# EAGLE design switchmod (EAGLE 7.7.0)
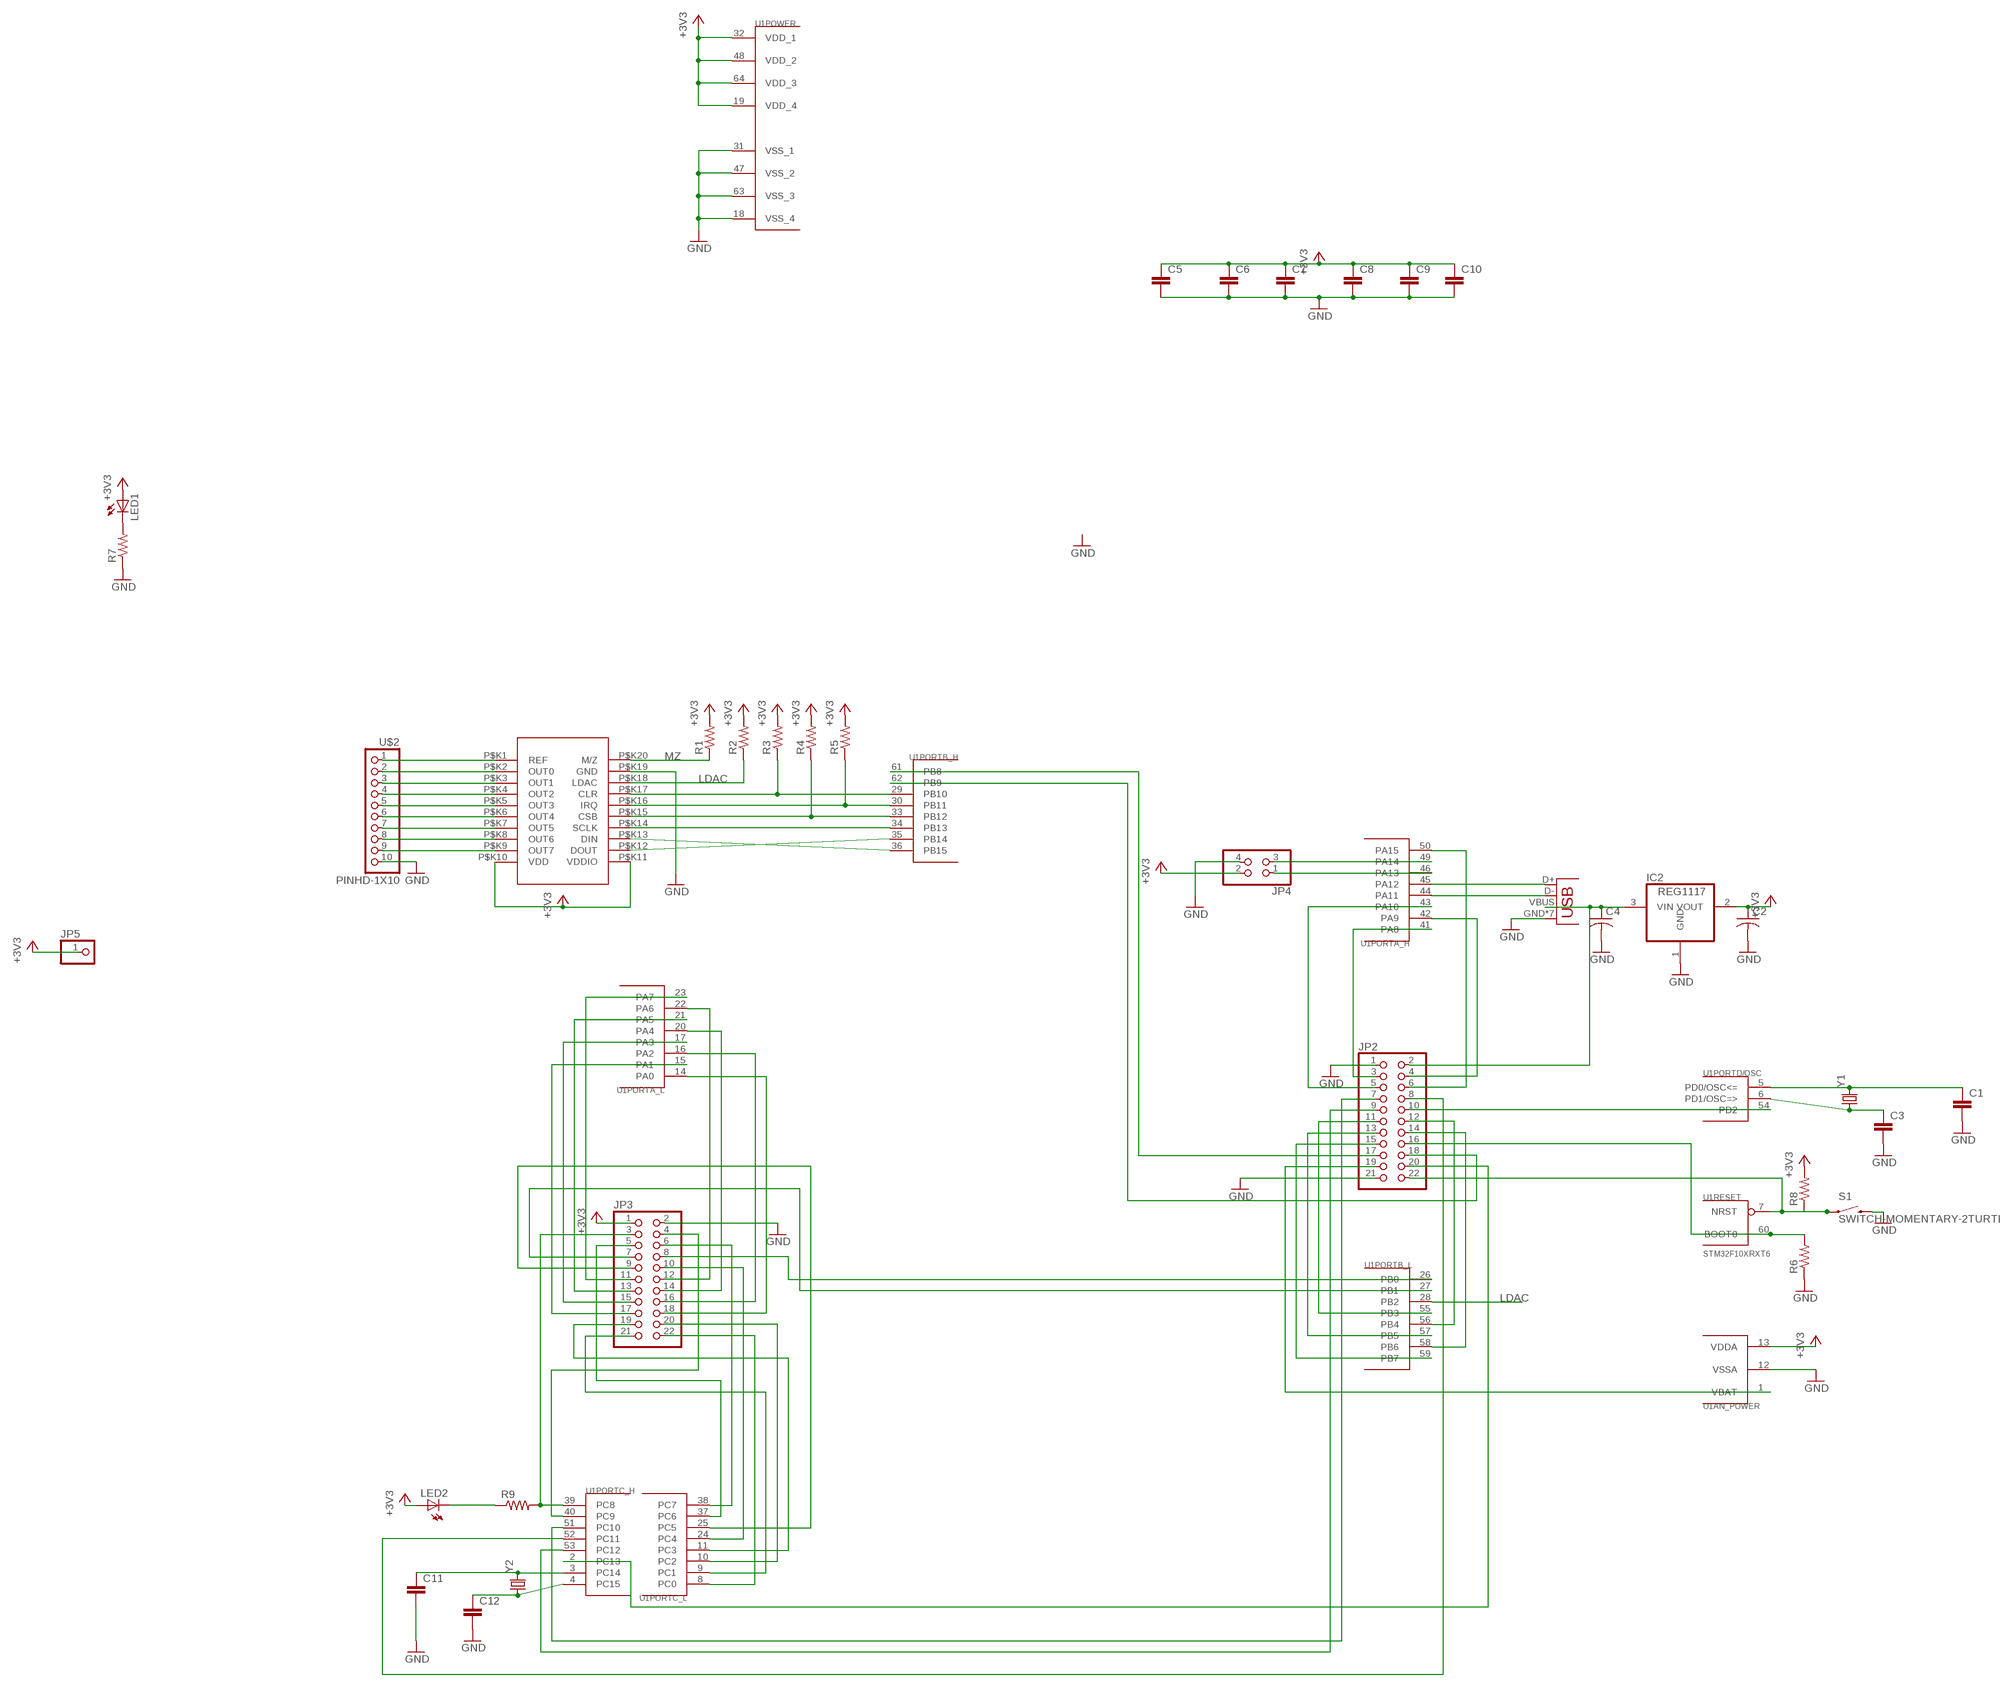
[diagram p0: schematic, sheet 1]

## Parts
C1  CAP0805  [0805]
C2  C-USC1210  [C1210]
C3  CAP0805  [0805]
C4  C-USC1210  [C1210]
C5  CAP0805  [0805]
C6  CAP0805  [0805]
C7  CAP0805  [0805]
C8  CAP0805  [0805]
C9  CAP0805  [0805]
C10  CAP0805  [0805]
C11  CAP0805  [0805]
C12  CAP0805  [0805]
IC2  REG1117  [SOT223]
JP2  PINHD-2X11  [2X11]
JP3  PINHD-2X11  [2X11]
JP4  PINHD-2X2  [2X02]
JP5  PINHD-1X1  [1X01]
LED1  LEDCHIP-LED0805  [CHIP-LED0805]
LED2  LEDCHIP-LED0805  [CHIP-LED0805]
R1  RESISTOR0805-RES  [0805]
R2  RESISTOR0805-RES  [0805]
R3  RESISTOR0805-RES  [0805]
R4  RESISTOR0805-RES  [0805]
R5  RESISTOR0805-RES  [0805]
R6  RESISTOR0805-RES  [0805]
R7  RESISTOR0805-RES  [0805]
R8  RESISTOR0805-RES  [0805]
R9  RESISTOR0805-RES  [0805]
S1  SWITCH-MOMENTARY-2TURTLE  [KMR2]
U1  STM32F10XRXT6  [TQFP64]
U$1  MAX572X  [TSSOP20]
U$2  PINHD-1X10  [1X10-BIG]
X1  USB-MICROB  [USB-MICROB]
Y1  CRYSTALHC49US  [HC49US]
Y2  CRYSTALTC26H_EZ  [TC26HEZ]

## Nets
+3V3: C2.1 C5.1 C6.1 C7.1 C8.1 C9.1 C10.1 IC2.2(VOUT) JP3.1 JP4.2 JP5.1 LED1.A LED2.A R1.2 R2.2 R3.2 R4.2 R5.2 R8.2 U1.13(AN_POWER:VDDA) U1.19(POWER:VDD_4) U1.32(POWER:VDD_1) U1.48(POWER:VDD_2) U1.64(POWER:VDD_3) U$1.P$K10(VDD) U$1.P$K11(VDDIO)
GND: C1.2 C2.2 C3.2 C4.2 C5.2 C6.2 C7.2 C8.2 C9.2 C10.2 C11.2 C12.2 IC2.1(GND) JP2.1 JP2.21 JP3.2 JP4.4 R6.1 R7.1 S1.3 U1.12(AN_POWER:VSSA) U1.18(POWER:VSS_4) U1.31(POWER:VSS_1) U1.47(POWER:VSS_2) U1.63(POWER:VSS_3) U$1.P$K19(GND) U$2.10 X1.GND X1.P1(GND) X1.P2(GND) X1.P3(GND) X1.P4(GND) X1.P5(GND) X1.P6(GND)
LDAC: R2.1 U1.28(PORTB_L:PB2) U$1.P$K18(LDAC)
MZ: R1.1 U$1.P$K20(M/Z)
N$1: JP2.22 R8.1 S1.1 U1.7(RESET:NRST)
N$3: U1.44(PORTA_H:PA11) X1.D-
N$4: U1.45(PORTA_H:PA12) X1.D+
N$5: C1.1 U1.5(PORTD/OSC:PD0/OSC<=) Y1.2
N$6: C3.1 U1.6(PORTD/OSC:PD1/OSC=>) Y1.1
N$7: U$1.P$K1(REF) U$2.1
N$8: U$1.P$K2(OUT0) U$2.2
N$9: U$1.P$K3(OUT1) U$2.3
N$10: U$1.P$K4(OUT2) U$2.4
N$11: U$1.P$K5(OUT3) U$2.5
N$12: U$1.P$K6(OUT4) U$2.6
N$13: U$1.P$K7(OUT5) U$2.7
N$14: U$1.P$K8(OUT6) U$2.8
N$15: U$1.P$K9(OUT7) U$2.9
N$16: U1.36(PORTB_H:PB15) U$1.P$K13(DIN)
N$17: U1.35(PORTB_H:PB14) U$1.P$K12(DOUT)
N$18: U1.34(PORTB_H:PB13) U$1.P$K14(SCLK)
N$19: R4.1 U1.33(PORTB_H:PB12) U$1.P$K15(CSB)
N$20: R5.1 U1.30(PORTB_H:PB11) U$1.P$K16(IRQ)
N$21: R3.1 U1.29(PORTB_H:PB10) U$1.P$K17(CLR)
N$22: JP4.3 U1.49(PORTA_H:PA14)
N$23: JP3.5 U1.37(PORTC_L:PC6)
N$24: JP4.1 U1.46(PORTA_H:PA13)
N$25: JP3.6 U1.38(PORTC_L:PC7)
N$26: JP2.16 R6.2 U1.60(RESET:BOOT0)
N$27: LED1.C R7.2
N$28: C11.1 U1.3(PORTC_H:PC14) Y2.2
N$29: C12.1 U1.4(PORTC_H:PC15) Y2.1
N$30: JP3.4 U1.40(PORTC_H:PC9)
N$31: JP2.3 U1.41(PORTA_H:PA8)
N$32: JP3.3 R9.2 U1.39(PORTC_H:PC8)
N$33: JP2.4 U1.42(PORTA_H:PA9)
N$34: JP2.5 U1.43(PORTA_H:PA10)
N$35: JP3.7 U1.27(PORTB_L:PB1)
N$36: JP3.8 U1.26(PORTB_L:PB0)
N$37: JP3.9 U1.25(PORTC_L:PC5)
N$38: JP3.10 U1.24(PORTC_L:PC4)
N$39: JP3.11 U1.23(PORTA_L:PA7)
N$40: JP3.12 U1.22(PORTA_L:PA6)
N$41: JP3.13 U1.21(PORTA_L:PA5)
N$42: JP3.14 U1.20(PORTA_L:PA4)
N$43: JP3.15 U1.17(PORTA_L:PA3)
N$44: JP3.16 U1.16(PORTA_L:PA2)
N$45: JP3.17 U1.15(PORTA_L:PA1)
N$46: JP3.18 U1.14(PORTA_L:PA0)
N$47: JP3.22 U1.8(PORTC_L:PC0)
N$48: JP3.21 U1.9(PORTC_L:PC1)
N$49: JP3.20 U1.10(PORTC_L:PC2)
N$50: JP3.19 U1.11(PORTC_L:PC3)
N$51: JP2.6 U1.50(PORTA_H:PA15)
N$52: JP2.7 U1.51(PORTC_H:PC10)
N$53: JP2.9 U1.53(PORTC_H:PC12)
N$54: JP2.8 U1.52(PORTC_H:PC11)
N$55: JP2.10 U1.54(PORTD/OSC:PD2)
N$56: JP2.11 U1.55(PORTB_L:PB3)
N$57: JP2.12 U1.56(PORTB_L:PB4)
N$58: JP2.13 U1.57(PORTB_L:PB5)
N$59: JP2.14 U1.58(PORTB_L:PB6)
N$60: JP2.15 U1.59(PORTB_L:PB7)
N$61: JP2.17 U1.61(PORTB_H:PB8)
N$62: JP2.18 U1.62(PORTB_H:PB9)
N$63: JP2.19 U1.1(AN_POWER:VBAT)
N$64: JP2.20 U1.2(PORTC_H:PC13)
N$65: LED2.C R9.1
N$66: C4.1 IC2.3(VIN) JP2.2 X1.VBUS

## Library data of the parts
C1 C3 C5-C12 = backplane:CAP: Capacitor Standard 0603 ceramic capacitor, and 0.1" leaded capacitor.
C2 C4 = backplane:C-US: CAPACITOR, American symbol
IC2 = backplane:REG1117: 800mA and 1A Low Dropout (LDO) Positive Regulator 1.8V, 2.5V, 2.85V, 3.3V, 5V, and Adj; MPN: REG1117; OC_FARNELL: 1097566; OC_NEWARK: 14P6981
JP2 JP3 = pinhead:PINHD-2X11: PIN HEADER
JP4 = pinhead:PINHD-2X2: PIN HEADER
JP5 = adafruit:PINHD-1X1: Pin header 1x1 for 0.1" spacing With round pins
LED1 LED2 = backplane:LED: LED OSRAM: - CHIPLED LG R971, LG N971, LY N971, LG Q971, LY Q971, LO R971, LY R971 LH N974, LH R974 LS Q976, LO Q976, LY Q976 LO Q996 - Hyper CHIPLED LW Q18S LB Q993, LB Q99A, LB R99A - SideLED LS A670, LO A670, LY A670, LG A670, LP A670 LB A673, LV A673, LT A673, LW A673 LH A674 LY A675 LS A676, LA A676, LO A676, LY A676, LW A676 LS A679, LY A679, LG A679 - Hyper Micro SIDELED® LS Y876, LA Y876, LO Y876, LY Y876 LT Y87S - SmartLED LW L88C, LW L88S LB L89C, LB L89S, LG L890 LS L89K, LO L89K, LY L89K LS L896, LA L896, LO L896, LY L896 - TOPLED LS T670, LO T670, LY T670, LG T670, LP T670 LSG T670, LSP T670, LSY T670, LOP T670, LYG T670 LG T671, LOG T671, LSG T671 LB T673, LV T673, LT T673, LW T673 LH T674 LS T676, LA T676, LO T676, LY T676, LB T676, LH T676, LSB T676, LW T676 LB T67C, LV T67C, LT T67C, LS T67K, LO T67K, LY T67K, LW E67C LS E67B, LA E67B, LO E67B, LY E67B, LB E67C, LV E67C, LT E67C LW T67C LS T679, LY T679, LG T679 LS T770, LO T770, LY T770, LG T770, LP T770 LB T773, LV T773, LT T773, LW T773 LH T774 LS E675, LA E675, LY E675, LS T675 LS T776, LA T776, LO T776, LY T776, LB T776 LHGB T686 LT T68C, LB T68C - Hyper Mini TOPLED® LB M676 - Mini TOPLED Santana® LG M470 LS M47K, LO M47K, LY M47K Source: http://www.osram.convergy.de/
R1-R9 = SparkFun-Passives:RESISTOR: Resistor Basic schematic elements and footprints for 0603, 1206, and PTH resistors.
S1 = Adafruit Feather M0 Adalogger:SWITCH-MOMENTARY-2: Various NO switches- pushbuttons, reed, etc
U1 = backplane:STM32F10XRXT6: STM32F101/103 64pin LQFP
U$1 = kevin:MAX572X
U$2 = adafruit:PINHD-1X10: Pin header 1x10 0.1" spacing With round pins
X1 = backplane:USB: USB Connectors USB-B-PTH is fully proven SKU : PRT-00139/CONN-08278 USB-miniB is fully proven SKU : PRT-00587 USB-A-PCB is untested. USB-A-H is throughly reviewed, but untested. Spark Fun Electronics SKU : PRT-00437 USB-B-SMT is throughly reviewed, but untested. Needs silkscreen touching up. USB-A-S has not been used/tested USB-MB-H has not been used/tested USB-MICROB has been used. CONN-09505; PROD_ID: CONN-09505
Y1 Y2 = backplane:CRYSTAL: Various standard crystals. Proven footprints.

## Board
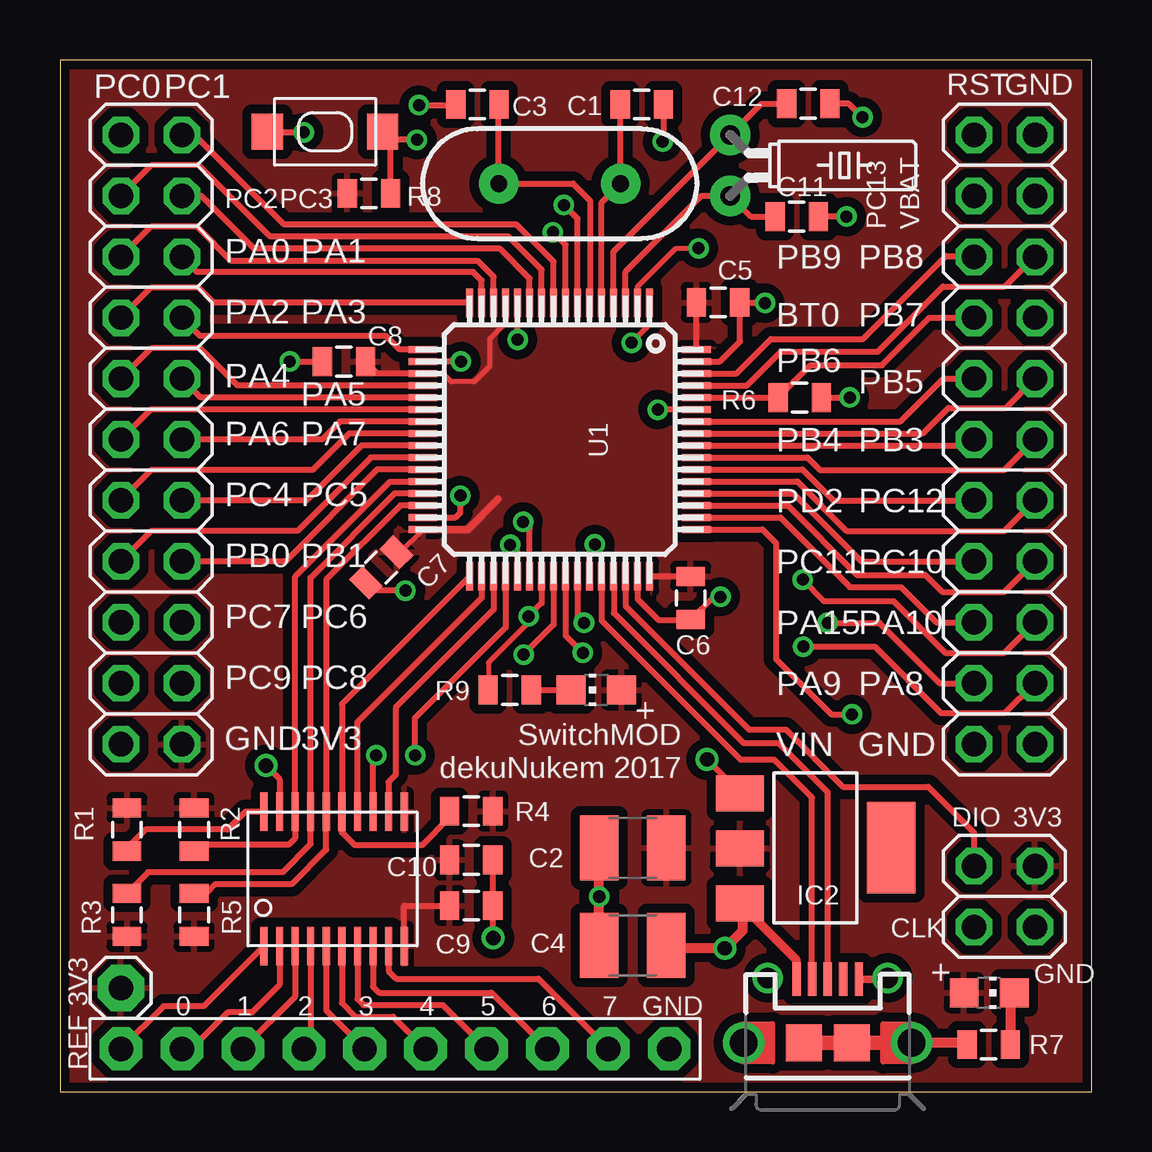
[diagram p1: board, top side]
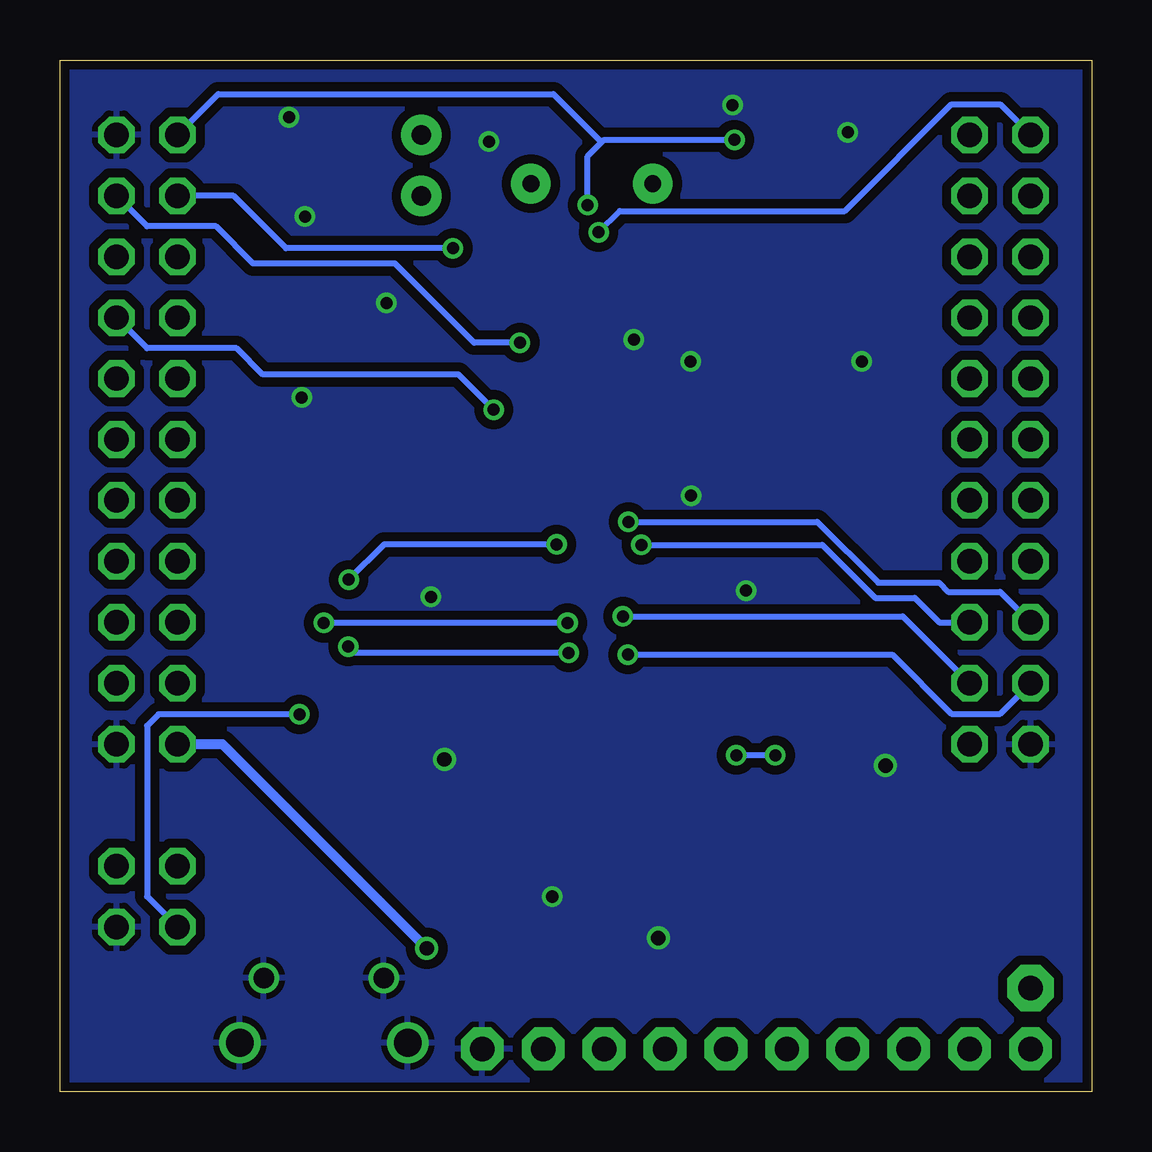
[diagram p2: board, bottom side, seen from below]

Size 43 x 43 mm. Coordinates in mm from the lower left corner, seen from the top.
Outline: 0,0 43,0 43,43 0,43 0,0
Copper layers (1*16): Top 0.035mm / dielectric 1.5mm / Bottom 0.035mm
Design rules "SparkFun-2-layer-TIGHT": minimum track width 7mil, minimum drill 15mil, track to track 7mil, track to pad 7mil, pad to pad 7mil, via to via 7mil, smd to smd 7mil, copper to edge 7mil, drill to drill 7mil, minimum pad ring 7mil, minimum via ring 7mil, stop-mask expansion 4mil, vias tented up to drill 25mil, thermal gap 10mil

### Footprints (pad centres in the part's own frame; a part is rotated, then mirrored left to right if it is on the bottom)
0805 = smd 0.8 x 1.2: 1 -0.9,0; 2 0.9,0
C1210 = smd 1.6 x 2.7: 1 -1.4,0; 2 1.4,0
SOT223 = smd 1.499 x 2.007: 1 -2.261,-3.15; 2 0.025,-3.15; 3 2.311,-3.15 | smd 3.81 x 2.007: 4 0,3.15
2X11 = drill 1.016 octagon: 1 -12.7,-1.27; 2 -12.7,1.27; 3 -10.16,-1.27; 4 -10.16,1.27; 5 -7.62,-1.27; 6 -7.62,1.27; 7 -5.08,-1.27; 8 -5.08,1.27; 9 -2.54,-1.27; 10 -2.54,1.27; 11 0,-1.27; 12 0,1.27; 13 2.54,-1.27; 14 2.54,1.27; 15 5.08,-1.27; 16 5.08,1.27; 17 7.62,-1.27; 18 7.62,1.27; 19 10.16,-1.27; 20 10.16,1.27; 21 12.7,-1.27; 22 12.7,1.27
2X02 = drill 1.016 octagon: 1 -1.27,-1.27; 2 -1.27,1.27; 3 1.27,-1.27; 4 1.27,1.27
1X01 = drill 1.016 pad 1.93 octagon: 1 0,0
CHIP-LED0805 = smd 1.2 x 1.2: A 0,-1.05; C 0,1.05
KMR2 = smd 1.3 x 1.5: 1 2.4,0; 3 -2.4,0
TQFP64 = smd 1.2 x 0.3: 1 -5.7,3.75; 2 -5.7,3.25; 3 -5.7,2.75; 4 -5.7,2.25; 5 -5.7,1.75; 6 -5.7,1.25; 7 -5.7,0.75; 8 -5.7,0.25; 9 -5.7,-0.25; 10 -5.7,-0.75; 11 -5.7,-1.25; 12 -5.7,-1.75; 13 -5.7,-2.25; 14 -5.7,-2.75; 15 -5.7,-3.25; 16 -5.7,-3.75; 33 5.7,-3.75; 34 5.7,-3.25; 35 5.7,-2.75; 36 5.7,-2.25; 37 5.7,-1.75; 38 5.7,-1.25; 39 5.7,-0.75; 40 5.7,-0.25; 41 5.7,0.25; 42 5.7,0.75; 43 5.7,1.25; 44 5.7,1.75; 45 5.7,2.25; 46 5.7,2.75; 47 5.7,3.25; 48 5.7,3.75 | smd 0.3 x 1.2: 17 -3.75,-5.7; 18 -3.25,-5.7; 19 -2.75,-5.7; 20 -2.25,-5.7; 21 -1.75,-5.7; 22 -1.25,-5.7; 23 -0.75,-5.7; 24 -0.25,-5.7; 25 0.25,-5.7; 26 0.75,-5.7; 27 1.25,-5.7; 28 1.75,-5.7; 29 2.25,-5.7; 30 2.75,-5.7; 31 3.25,-5.7; 32 3.75,-5.7; 49 3.75,5.7; 50 3.25,5.7; 51 2.75,5.7; 52 2.25,5.7; 53 1.75,5.7; 54 1.25,5.7; 55 0.75,5.7; 56 0.25,5.7; 57 -0.25,5.7; 58 -0.75,5.7; 59 -1.25,5.7; 60 -1.75,5.7; 61 -2.25,5.7; 62 -2.75,5.7; 63 -3.25,5.7; 64 -3.75,5.7
TSSOP20 = smd 0.3 x 1.6: P$K1 -2.93,-2.825; P$K2 -2.28,-2.825; P$K3 -1.63,-2.825; P$K4 -0.98,-2.825; P$K5 -0.33,-2.825; P$K6 0.32,-2.825; P$K7 0.97,-2.825; P$K8 1.62,-2.825; P$K9 2.27,-2.825; P$K10 2.92,-2.825; P$K11 2.92,2.775; P$K12 2.27,2.775; P$K13 1.62,2.775; P$K14 0.97,2.775; P$K15 0.32,2.775; P$K16 -0.33,2.775; P$K17 -0.98,2.775; P$K18 -1.63,2.775; P$K19 -2.28,2.775; P$K20 -2.93,2.775
1X10-BIG = drill 1.016 pad 1.778 octagon: 1 -11.43,0; 2 -8.89,0; 3 -6.35,0; 4 -3.81,0; 5 -1.27,0; 6 1.27,0; 7 3.81,0; 8 6.35,0; 9 8.89,0; 10 11.43,0
USB-MICROB = smd 0.35 x 1.4: D+ 0,2.65; D- -0.65,2.65; GND 1.3,2.65; ID 0.65,2.65; VBUS -1.3,2.65 | smd 1.5 x 1.55: P1 -1,0; P2 1,0 | drill 1.15 pad 1.422: P3 -3.5,0; P4 3.5,0 | drill 0.85 pad 1.27: P5 -2.5,2.7; P6 2.5,2.7
HC49US = drill 0.7 pad 1.651: 1 -2.54,0; 2 2.54,0
TC26HEZ = drill 0.813 pad 1.676: 1 -1.27,0; 2 1.27,0

### Placement (x,y rotation side)
C1  24.26,41.15 0 top
C2  23.88,10.16 180 top
C3  17.4,41.15 180 top
C4  23.88,6.1 180 top
C5  27.43,32.89 0 top
C6  26.29,20.57 270 top
C7  13.39,21.84 225 top
C8  11.84,30.43 180 top
C9  17.14,7.75 0 top
C10  17.14,9.65 0 top
C11  30.71,36.47 0 top
C12  31.19,41.17 0 top
IC2  31.5,10.16 270 top
JP2  39.37,27.18 90 top
JP3  3.81,27.18 90 top
JP4  39.37,8.13 270 top
JP5  2.54,4.32 0 top
LED1  38.73,4.11 270 top
LED2  22.35,16.74 90 top
R1  2.79,10.92 90 top
R2  5.59,10.92 90 top
R3  2.79,7.37 270 top
R4  17.14,11.68 0 top
R5  5.59,7.37 270 top
R6  30.84,28.93 180 top
R7  38.71,1.96 0 top
R8  12.88,37.44 180 top
R9  18.75,16.74 180 top
S1  11.05,40.01 0 top
U1  20.83,27.18 270 top
U$1  11.43,8.89 0 top
U$2  13.97,1.78 0 top
X1  32,2.03 0 top
Y1  20.83,37.85 0 top
Y2  27.94,38.61 270 top

### Tracks (layer width: path | path; a pad name or v marks a point on that pad's centre or on a via)
+3V3
  Top 0.203: C7.1 14.18,22.48 U1.32 | 18.59,32.86 18.59,32.05 17.91,31.37 17.91,30.23 17.27,29.59 16.31,29.59 15.98,29.92 U1.19
  Top 0.254: C6.1 U1.48 | 18.59,32.86 U1.13 | U1.64 C5.1 | U1.19 13.24,29.93 C8.1 | U$1.P$K10 14.35,7.75 16.18,7.75
  Top 0.305: U1.32 17,23.43 18.26,24.69
  pour Top (isolate 0.381): 0,43 0,0 43,0 43,43
GND  (via drill 0.5, 0.51, 0.6)
  Top 0.254: 34.45,4.68 X1.P6 | 14.95,41.13 v14.96,41.12 16.47,41.12 C3.2 | C1.2 25.16,39.63 v25.12,39.6 | C10.2 C9.2 18.06,7.73 v18.06,6.4 | v16.71,30.43 U1.18 | v19.07,31.34 U1.12 | U1.63 27.51,30.43 28.35,31.27 28.35,32.88 | 28.35,32.88 C5.2 | R6.1 v32.92,28.93 | v8.59,13.59 9.15,13.02 U$1.P$K19 | U1.31 16.49,23.93 16.69,24.13 v16.69,24.84 | v27.53,20.62 27.24,20.62 C6.2 26.27,19.66 24.94,19.66 24.08,20.52 U1.47 | S1.3 8.67,39.98 v10.16,39.98 | v9.58,30.43 C8.2 | R7.1 37.73,2.03 | v26.98,13.84 28.35,12.47 IC2.1 | 12.65,21.21 C7.2 | C7.2 12.83,21.21 | v14.4,20.88 13.08,20.88 C7.2 | 28.35,32.88 29.38,32.88 v29.39,32.87 | v32.79,36.47 C11.2 | v33.45,40.62 32.89,41.17 C12.2
  Top 0.305: X1.GND 34.45,4.68
  Top 0.406: 37.73,2.03 X1.P4 | C4.2 v22.48,8.13 C2.2
  Top 0.61: X1.P4 X1.P2 X1.P1
  pour Bottom (isolate 0.381): 0,43 0,0 43,0 43,43
LDAC
  Top 0.254: U$1.P$K18 9.8,11.12 | 9.8,11.12 9.8,10.56 9.53,10.29 5.85,10.29 R2.1 | 9.8,11.12 9.8,11.13 9.8,21.46 13.77,25.43 U1.28
MZ
  Top 0.254: U$1.P$K20 7.73,11.66 6.99,10.92 3.57,10.92 2.79,10.15 R1.1
N$1  (via drill 0.5)
  Top 0.254: U1.7 21.58,36.38 v21.01,36.96 | v14.88,39.67 13.78,39.67 S1.1 13.78,39.68 R8.1
  Bottom 0.254: v14.88,39.67 20.32,39.67 20.42,39.57 | 20.42,39.57 22.43,41.58 36.4,41.58 JP2.22 | v21.01,36.96 21.01,38.99 20.42,39.57
N$3
  Top 0.254: X1.D- 31.35,12.26 29.77,13.84 28.37,13.84 22.58,19.63 U1.44
N$4
  Top 0.254: X1.D+ 32,12.47 29.95,14.53 28.5,14.53 23.09,19.94 23.09,21.47 U1.45
N$5
  Top 0.254: C1.1 23.37,41.14 Y1.2 22.58,37.06 U1.5
N$6
  Top 0.254: C3.1 18.29,41.14 Y1.1 21.39,37.85 22.1,37.13 22.1,32.9 U1.6
N$7
  Top 0.254: U$1.P$K1 5.99,3.56 4.32,3.56 U$2.1
N$8
  Top 0.254: U$1.P$K2 9.15,4.45 8,3.3 6.99,3.3 5.46,1.78 U$2.2
N$9
  Top 0.254: U$1.P$K3 9.8,3.96 U$2.3
N$10
  Top 0.254: U$1.P$K4 10.45,2.07 U$2.4
N$11
  Top 0.254: U$1.P$K5 11.1,3.38 U$2.5
N$12
  Top 0.254: U$1.P$K6 11.75,3.69 12.32,3.12 13.89,3.12 U$2.6
N$13
  Top 0.254: U$1.P$K7 12.4,3.86 12.65,3.61 15.95,3.61 U$2.7
N$14
  Top 0.254: U$1.P$K8 13.05,4.37 13.31,4.12 17.98,4.12 U$2.8
N$15
  Top 0.254: U$1.P$K9 13.7,5.02 14.02,4.7 19.94,4.7 U$2.9
N$16  (via drill 0.5)
  Top 0.254: U$1.P$K13 13.05,13.89 v13.18,14.02 | U1.36 18.58,19.34 14.78,15.54 14.78,14.05 v14.81,14.02
  Bottom 0.254: v13.18,14.02 v14.81,14.02
N$17
  Top 0.254: U1.35 18.08,20.09 13.99,16 13.99,13.21 13.69,12.9 U$1.P$K12
N$18
  Top 0.254: U1.34 17.58,20.57 12.39,15.39 U$1.P$K14
N$19
  Top 0.254: R4.1 16.25,11.42 15.09,10.26 12.29,10.26 11.76,10.79 11.76,11.65 U$1.P$K15 11.76,16.15 U1.33
N$20
  Top 0.254: U1.30 14.19,24.43 11.1,21.34 U$1.P$K16 | U$1.P$K16 | U$1.P$K16 11.1,10.08 9.65,8.64 6.48,8.64 6.11,8.27 R5.1
N$21
  Top 0.254: U1.29 13.96,24.93 10.44,21.41 10.45,21.4 U$1.P$K17 | U$1.P$K17 | R3.1 3.67,9.14 9.27,9.14 10.45,10.32 U$1.P$K17
N$22  (via drill 0.5)
  Top 0.254: U1.49 29.28,23.43 29.84,22.86 29.84,18.03 32.16,15.72 v33.02,15.72
  Bottom 0.254: v33.02,15.72 38.89,15.72 39.37,15.24 39.37,8.13 JP4.3
N$23  (via drill 0.5)
  Top 0.254: U1.37 19.08,22.48 v18.77,22.78
  Bottom 0.254: JP3.5 6.35,19.56 7.37,20.57 9.02,20.57 11.23,22.78 v18.77,22.78
N$24
  Top 0.254: U1.46 23.58,20.24 28.73,15.09 30.25,15.09 32.64,12.7 36.2,12.7 38.1,10.79 JP4.1
N$25  (via drill 0.5)
  Top 0.254: U1.38 19.58,23.48 v19.3,23.75
  Bottom 0.254: JP3.6 3.81,20.83 5.97,20.83 6.35,21.21 8.89,21.21 11.43,23.75 v19.3,23.75
N$26
  Top 0.254: U1.60 R6.2 31.28,30.28 34.27,30.28 36.25,32.26 JP2.16
N$27
  Top 0.406: LED1.C 39.61,4.12 R7.2
N$28
  Top 0.254: U1.3 23.58,34.17 26.75,37.34 Y2.2 28.8,36.47 C11.1
N$29
  Top 0.254: U1.4 23.08,35.02 Y2.1 29.23,41.17 C12.1
N$30  (via drill 0.5)
  Top 0.254: U1.40 20.58,19.46 v19.33,18.21
  Bottom 0.254: JP3.4 3.81,15.75 5.84,15.75 8.31,18.21 v19.33,18.21
N$31  (via drill 0.5)
  Top 0.254: v30.99,18.54 33.96,18.54 36.73,15.77 39.4,15.77 JP2.3 | U1.41 21.08,19 v21.79,18.29
  Bottom 0.254: v21.79,18.29 30.73,18.29 v30.99,18.54
N$32  (via drill 0.5)
  Top 0.203: v19.53,19.81 19.53,19.56 17.86,17.88 R9.2
  Top 0.254: U1.39 20.08,20.36 v19.53,19.81
  Bottom 0.254: v19.53,19.81 7.87,19.81 JP3.3
N$33  (via drill 0.5)
  Top 0.254: U1.42 21.58,19.8 v21.84,19.53 | v32,19.53 34.16,19.53 36.68,17.02 JP2.4
  Bottom 0.254: v21.84,19.53 v32,19.53
N$34  (via drill 0.5)
  Top 0.254: U1.43 22.08,22.59 v22.3,22.81 | v30.96,21.34 31.85,20.45 34.75,20.45 36.91,18.29 39.37,18.29 JP2.5
  Bottom 0.254: v22.3,22.81 29.49,22.81 v30.96,21.34
N$35
  Top 0.254: U1.27 13.23,25.93 9.4,22.1 JP3.7
N$36
  Top 0.254: U1.26 12.97,26.43 9.91,23.37 3.81,23.37 JP3.8
N$37
  Top 0.254: U1.25 12.58,26.93 10.29,24.64 JP3.9
N$38
  Top 0.254: U1.24 12.06,27.43 10.54,25.91 3.81,25.91 JP3.10
N$39
  Top 0.254: U1.23 11.67,27.93 10.92,27.18 JP3.11
N$40
  Top 0.254: U1.22 3.79,28.43 JP3.12
N$41
  Top 0.254: U1.21 5.87,28.93 JP3.13
N$42
  Top 0.254: U1.20 7.4,29.43 5.84,30.99 3.81,30.99 JP3.14
N$43
  Top 0.254: U1.17 14.16,30.93 13.59,31.5 5.84,31.5 JP3.15
N$44
  Top 0.254: U1.16 6.42,32.88 5.79,33.5 3.79,33.5 JP3.16
N$45
  Top 0.254: U1.15 17.58,33.81 17.22,34.16 5.71,34.16 JP3.17
N$46
  Top 0.254: U1.14 18.08,33.97 17.42,34.62 7.14,34.62 5.71,36.04 3.79,36.04 JP3.18
N$47  (via drill 0.5)
  Top 0.254: U1.8 21.08,35.28 v20.55,35.81
  Bottom 0.254: 2.54,39.85 JP3.22 3.81,41.15 5.84,41.15 10.29,36.7 19.66,36.7 v20.55,35.81
N$48
  Top 0.254: U1.9 20.58,34.59 19.02,36.14 9.35,36.14 5.64,39.85 5.11,39.85 JP3.21
N$49
  Top 0.254: U1.10 20.08,34.25 18.69,35.64 8.76,35.64 5.79,38.61 3.81,38.61 JP3.20
N$50
  Top 0.254: U1.11 19.58,33.89 18.34,35.13 8.1,35.13 5.89,37.34 JP3.19
N$51
  Top 0.254: U1.50 30.02,23.93 32.92,21.03 35.05,21.03 36.52,19.56 JP2.6
N$52
  Top 0.254: U1.51 30.33,24.43 33.22,21.54 36.07,21.54 36.78,20.83 39.37,20.83 JP2.7
N$53
  Top 0.254: U1.53 30.73,25.43 32.79,23.37 39.37,23.37 JP2.9
N$54
  Top 0.254: U1.52 30.57,24.93 33.4,22.1 JP2.8
N$55
  Top 0.254: U1.54 30.94,25.93 32.23,24.64 JP2.10
N$56
  Top 0.254: U1.55 31.15,26.43 31.67,25.91 39.37,25.91 JP2.11
N$57
  Top 0.254: U1.56 37.85,26.93 JP2.12
N$58
  Top 0.254: U1.57 35.96,27.43 37.03,28.5 39.42,28.5 JP2.13
N$59
  Top 0.254: U1.58 35.04,27.93 36.83,29.72 JP2.14
N$60  (via drill 0.5)
  Top 0.254: U1.59 v24.92,28.43 v24.92,28.42
  Bottom 0.254: v24.92,28.42 26.39,29.9 34.54,29.9 35.64,30.99 39.37,30.99 JP2.15
N$61
  Top 0.254: U1.61 28.64,29.43 30.05,30.84 34.09,30.84 36.8,33.55 39.4,33.55 JP2.17
N$62
  Top 0.254: U1.62 28.2,29.93 29.64,31.37 33.48,31.37 36.93,34.82 38.08,34.82 JP2.18
N$63  (via drill 0.5)
  Top 0.203: 24.58,33.09 U1.1 24.58,31.97 v23.82,31.22
  Bottom 0.254: v23.82,31.22 25.73,31.22 29.03,34.52 34.95,34.52 36.5,36.07 39.37,36.07 JP2.19
N$64  (via drill 0.5)
  Top 0.203: U1.2 24.08,33.55 25.68,35.15 v26.62,35.15
  Bottom 0.254: v26.62,35.15 33.58,35.15 35.76,37.34 JP2.20
N$65
  Top 0.254: R9.1 LED2.C
N$66  (via drill 0.6)
  Top 0.356: X1.VBUS 30.7,5.49 28.45,7.75 IC2.3
  Top 0.406: 28.45,7.75 28.45,6.71 v27.71,5.97 25.28,5.97 C4.1
  Bottom 0.406: v27.71,5.97 36.22,14.48 JP2.2

### Text on the board
tNames: RST | GND | PC0 | PC1 | PC2 | PC3 | PC13 | VBAT | PA0 | PA1 | PB9 | PB8 | PA2 | PA3 | BT0 | PB7 | PB6 | PA4 | PA5 | PB5 | PA6 | PA7 | PB4 | PB3 | PC4 | PC5 | PD2 | PC12 | PB0 | PB1 | PC11 | PC10 | PC7 | PC6 | PA15 | PA10 | PC9 | PC8 | PA9 | PA8 | SwitchMOD / dekuNukem 2017 | GND | 3V3 | VIN | GND | DIO | 3V3 | CLK | GND | 3V3 | 0 | 1 | 2 | 3 | 4 | 5 | 6 | 7 | GND | REF